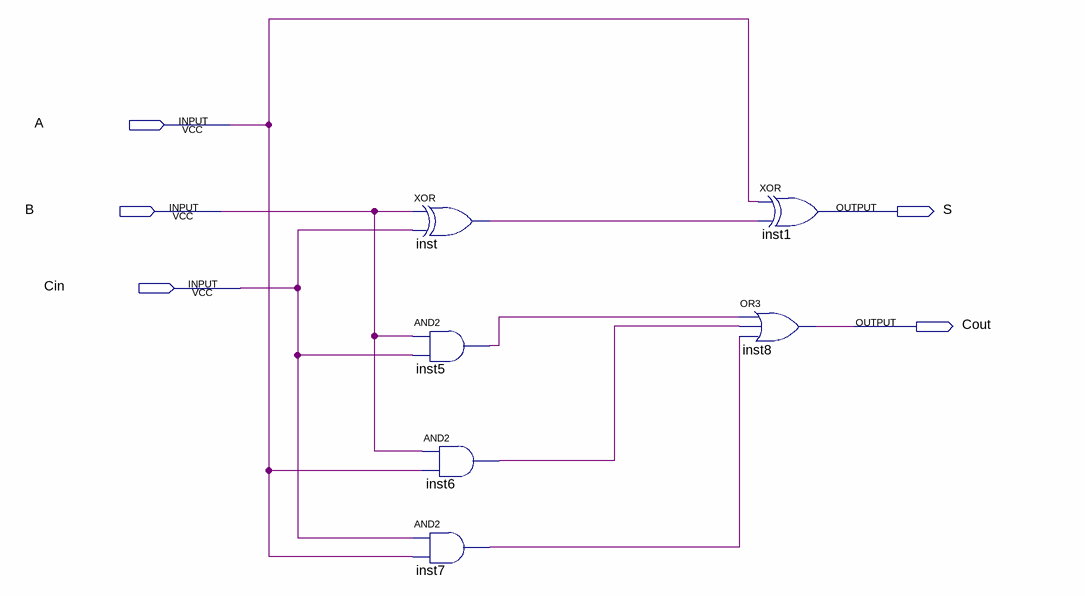
[diagram p0: schematic sheet]
// Quartus schematic SumadorBlock1.bdf as structural Verilog: 6 symbols, 5 pins
module SumadorBlock1 (
  input  A,
  input  B,
  input  Cin,
  output S,
  output Cout
);

  wire inst5_out, inst6_out, inst7_out, inst_out;

  xor inst (inst_out, B, Cin);
  and inst5 (inst5_out, B, Cin);
  and inst6 (inst6_out, B, A);
  and inst7 (inst7_out, Cin, A);
  xor inst1 (S, A, inst_out);
  or inst8 (Cout, inst5_out, inst6_out, inst7_out);
endmodule
